# Altium schematic sheet 04_CapTouch.SchDoc: ECE315 Analog
size A; Date: 4/25/2017; ApprovedBy: JSK; CheckedBy: JSK; Author: JSK; CompanyName: University of Wisconsin; DrawnBy: JSK; Engineer: JSK; Organization: ECE 315; Address1: College of Engineering; Address2: 1415 Engineering Drive; Address3: Madison, WI 53706; Address4: ECE 315 Fall 2017; Revision: A; SheetNumber: 2; SheetTotal: 2; AssemblyNumber: EMG001; ApprovedDate: 4/25/2017
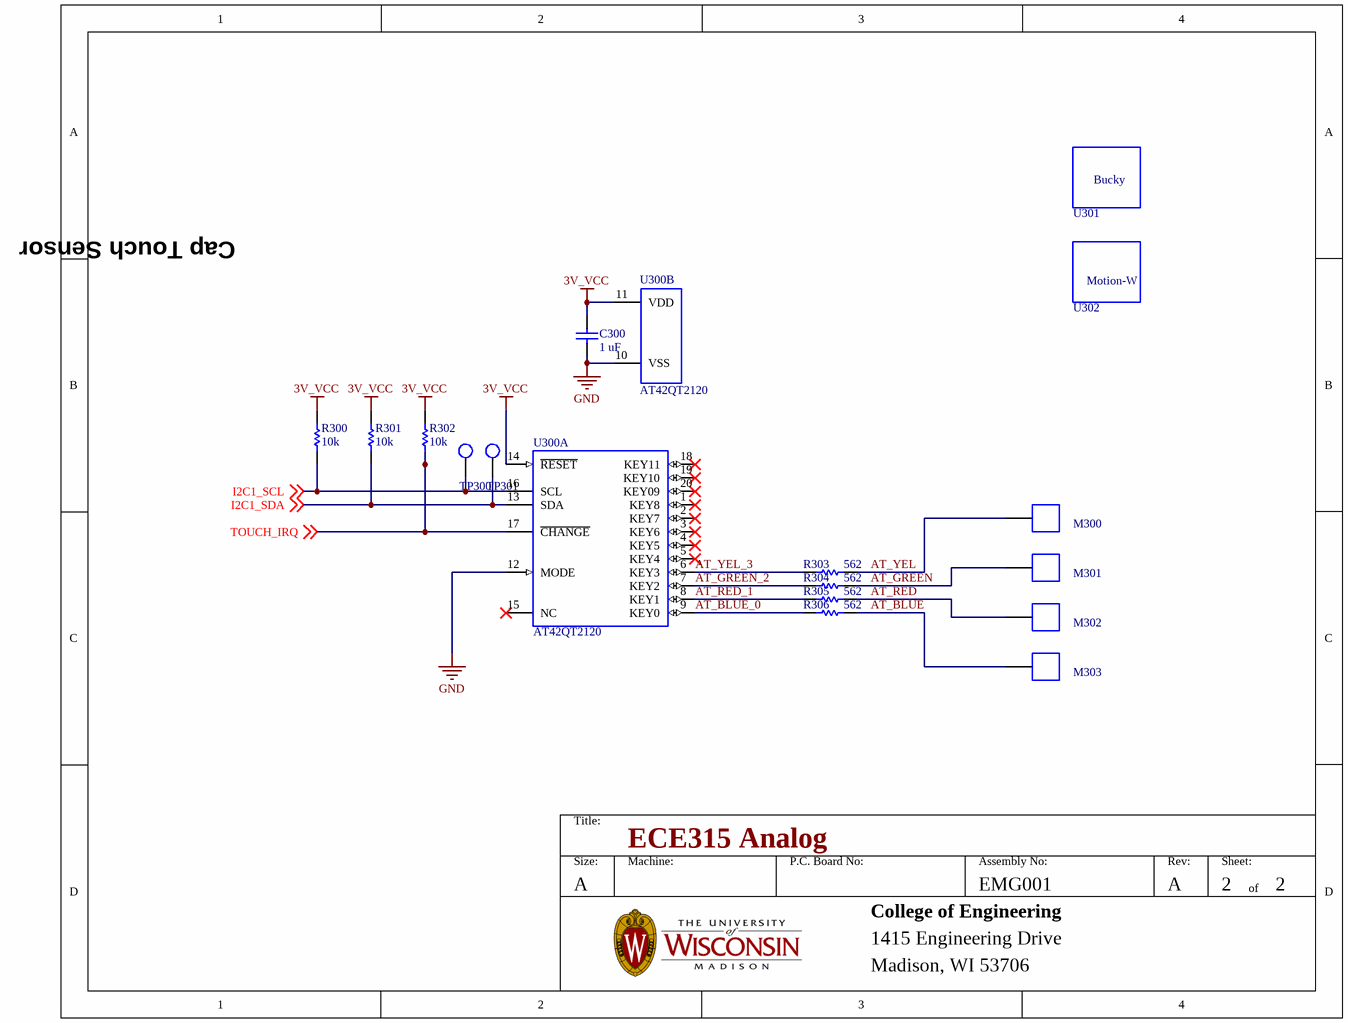
[diagram p0: 04_CapTouch.SchDoc]

## Parts
C300  Capacitance: 1 uF  [CAP_0805]  (hidden comment: CAP_0805_U_001.00)
M300  Mech_TouchPad  [TouchPad]  (value not drawn)  (no BOM)
M301  Mech_TouchPad  [TouchPad]  (value not drawn)  (no BOM)
M302  Mech_TouchPad  [TouchPad]  (value not drawn)  (no BOM)
M303  Mech_TouchPad  [TouchPad]  (value not drawn)  (no BOM)
R300  10K
R301  10K
R302  10K
R303  Resistance (Ohms): 562  [RES_0805]  (hidden comment: RES_0805_R_562_00)
R304  Resistance (Ohms): 562  [RES_0805]  (hidden comment: RES_0805_R_562_00)
R305  Resistance (Ohms): 562  [RES_0805]  (hidden comment: RES_0805_R_562_00)
R306  Resistance (Ohms): 562  [RES_0805]  (hidden comment: RES_0805_R_562_00)
TP300  TP_1206  [TP-SMC-1206]  (value not drawn)
TP301  TP_1206  [TP-SMC-1206]  (value not drawn)
U300  value AT42QT2120  [SOIC127P1030-20M]  (hidden comment: IC_AT42QT2120)  (parts A,B of 2)
U301  Bucky  [BuckyBadger]  (value not drawn)  (no BOM)
U302  Motion_W  [Motion_W]  (value not drawn)  (no BOM)

## Nets
3V_VCC: C300.1 R300.2 R301.2 R302.2 U300.11(VDD) U300.14(~{RESET})
GND: C300.2 U300.10(VSS) U300.12(MODE)
AT_BLUE: M303.1 R306.2
AT_BLUE_0: R306.1 U300.9(KEY0)
AT_GREEN: M301.1 R304.2
AT_GREEN_2: R304.1 U300.7(KEY2)
AT_RED: M302.1 R305.2
AT_RED_1: R305.1 U300.8(KEY1)
AT_YEL: M300.1 R303.2
AT_YEL_3: R303.1 U300.6(KEY3)
I2C1_SCL: R300.1 TP300.1 U300.16(SCL) ; off-sheet I2C1_SCL
I2C1_SDA: R301.1 TP301.1 U300.13(SDA) ; off-sheet I2C1_SDA
TOUCH_IRQ: R302.1 U300.17(~{CHANGE}) ; off-sheet TOUCH_IRQ

Not connected (* = marked no-connect by the designer): U300 1(KEY8)* 2(KEY7)* 3(KEY6)* 4(KEY5)* 5(KEY4)* 15(NC)* 18(KEY11)* 19(KEY10)* 20(KEY09)*

## Notes on the sheet
- Cap Touch Sensor
- Title:
- Size:
- A
- Machine:
- P.C. Board No:
- Assembly No:
- Rev:
- Sheet:
- of
- College of Engineering
- 1415 Engineering Drive
- Madison, WI 53706
- (in symbol Motion_W) Motion-W

## Library data of the parts
C300 = CAP_0805_U_001.00: CAP CER 1UF 16V 10% X7R 0805; Manufacturer: Kemet; Manufacturer Part Number: C0805C105K4RACTU; Part # Aliases: C0805C105K4RAC7800; Capacitance - nF: 1000 nF; Case Height: 0.9 mm; Case Length: 2 mm; Case Width: 1.2 mm; Class: Class 1; Dissipation Factor DF: 5; Temperature Coefficient / Code: +/- 15 %; Type: SMD MLCC X7R 6.3 - 250 VDC Commerical Grade; Tolerance: 10 %; Supplier 1: Digikey; Supplier Part Number 1: 399-1284-1-ND; Stock 1: 692931; Pricing 1: 1=0.12, 10=0.087, 100=0.0407, 500=0.0286, 1000=0.0236 (USD); Brand: Kemet; Case Code - in: 0805; Case Code - mm: 2012; Dimensions: 1.2 mm W x 2 mm L x 0.9 mm H; Dielectric: X7R; Lead Spacing: 0.75 mm; Factory Pack Quantity: 2500; Voltage Rating: 16 V; Product Category: Multilayer Ceramic Capacitors MLCC - SMD/SMT; RoHS: Details; Minimum Operating Temperature: - 55 C; Maximum Operating Temperature: + 125 C; Product: General Type MLCCs; Operating Temperature Range: - 55 C to + 125 C; Package / Case: 0805 (2012 metric); Packaging: Reel; Series: C0805C; Termination Style: SMD/SMT; Voltage Rating DC: 16 V; ComponentLink1URL: https://datasheet.ciiva.com/14585/70095383-14585511.pdf; ComponentLink1Description: https://datasheet.ciiva.com/14585/70095383-14585511.pdf; ComponentLink2URL: https://datasheet.ciiva.com/6074/1722731-6074364.pdf; ComponentLink2Description: https://datasheet.ciiva.com/6074/1722731-6074364.pdf; ComponentLink3URL: https://datasheet.ciiva.com/14603/70095383-14603388.pdf; ComponentLink3Description: https://datasheet.ciiva.com/14603/70095383-14603388.pdf; ComponentLink4URL: https://datasheet.ciiva.com/28692/1851736-28692942.pdf; ComponentLink4Description: https://datasheet.ciiva.com/28692/1851736-28692942.pdf; ComponentLink5URL: https://datasheet.ciiva.com/39122/docfinderpartnumberc0402c102k5ractu-39122926.pdf; ComponentLink5Description: https://datasheet.ciiva.com/39122/docfinderpartnumberc0402c102k5ractu-39122926.pdf
M300-M303 = Mech_TouchPad: Capacative Touch Sensor Pad
R300-R302 = RES_0805_K_010.00: RES SMD 10K OHM 1% 1/8W 0805; Manufacturer Part Number: ERJ-6ENF1002V; Manufacturer: Panasonic / Panasonic ECG; Temperature Coefficient: ± 200ppm/°C; Voltage Rating: 150V; Resistor Element Material: Thick Film; Power Rating: 125mW; Resistor Case Style: 0805; No. of Pins: 2; Product Range: PANASONIC - ERJ Series; Supplier 1: Digikey; Stock 1: 87; Pricing 1: 1=0.1, 10=0.041, 100=0.0167, 1000=0.0075, 2500=0.0065 (USD); Resistance Tolerance: ± 1%; Resistor Mounting: SMD; Series: ERJ; Resistor Element Type: Thick Film; ComponentLink1URL: https://datasheet.ciiva.com/11808/0900766b80f80784-11808080.pdf; ComponentLink1Description: https://datasheet.ciiva.com/11808/0900766b80f80784-11808080.pdf; ComponentLink2URL: https://datasheet.ciiva.com/16514/aoa0000ce2-16514021.pdf; ComponentLink2Description: https://datasheet.ciiva.com/16514/aoa0000ce2-16514021.pdf; ComponentLink3URL: https://datasheet.ciiva.com/27055/1988971-27055733.pdf; ComponentLink3Description: https://datasheet.ciiva.com/27055/1988971-27055733.pdf; ComponentLink4URL: https://datasheet.ciiva.com/16759/70260748-16759350.pdf; ComponentLink4Description: https://datasheet.ciiva.com/16759/70260748-16759350.pdf; ComponentLink5URL: https://datasheet.ciiva.com/16725/70260748-16725031.pdf; ComponentLink5Description: https://datasheet.ciiva.com/16725/70260748-16725031.pdf; ComponentLink6URL: https://datasheet.ciiva.com/7830/426256-7830745.pdf; ComponentLink6Description: https://datasheet.ciiva.com/7830/426256-7830745.pdf; ComponentLink7URL: https://datasheet.ciiva.com/46372/1678782-46372714.pdf; ComponentLink7Description: https://datasheet.ciiva.com/46372/1678782-46372714.pdf; ComponentLink8URL: https://datasheet.ciiva.com/46372/1678782-46372715.pdf; ComponentLink8Description: https://datasheet.ciiva.com/46372/1678782-46372715.pdf; ComponentLink9URL: https://datasheet.ciiva.com/17212/aoa0000ce2-17212108.pdf; ComponentLink9Description: https://datasheet.ciiva.com/17212/aoa0000ce2-17212108.pdf; ComponentLink10URL: https://datasheet.ciiva.com/30140/aoa0000ce2-30140236.pdf; ComponentLink10Description: https://datasheet.ciiva.com/30140/aoa0000ce2-30140236.pdf; ComponentLink11URL: https://datasheet.ciiva.com/16740/aoa0000ce2-16740669.pdf; ComponentLink11Description: https://datasheet.ciiva.com/16740/aoa0000ce2-16740669.pdf; ComponentLink12URL: https://datasheet.ciiva.com/24070/aoa0000ce2-24070702.pdf; ComponentLink12Description: https://datasheet.ciiva.com/24070/aoa0000ce2-24070702.pdf; Supplier Part Number 1: P10.0KCCT-ND; Resistance: 10k
R303-R306 = RES_0805_R_562_00: RES SMD 562 OHM 1% 1/8W 0805; Manufacturer: Panasonic / Panasonic ECG; Manufacturer Part Number: ERJ-6ENF5620V; Power (Watts): 0.125W, 1/8W; Temperature Coefficient: ±100ppm/°C; EDA / CAD Models: Download from Accelerated Designs; Online Catalog: ERJ Series; Kits: RSM2CA-ND  - RESISTR KIT 100-976 1/8W 4800PCS RSM2C-ND  - RES KIT 100-976 1/8W 19200PCS; Other Names: ERJ-6ENF5620 ERJ6ENF5620 P562CBK P562CCT; Supplier 1: Digikey; Supplier Part Number 1: P562CCT-ND; Category: Resistors; Stock 1: 13935; Pricing 1: 1=0.1, 10=0.041, 100=0.0167, 1000=0.0075, 2500=0.0065 (USD); Packaging: Cut Tape (CT); Tolerance: ±1%; Composition: Thick Film; Features: Automotive AEC-Q200; Operating Temperature: -55°C ~ 155°C; Package / Case: 0805 (2012 Metric); Supplier Device Package: 0805; Size / Dimension: 0.079" L x 0.049" W (2.00mm x 1.25mm); Height: 0.028" (0.70mm); Number of Terminations: 2; ComponentLink1URL: https://datasheet.ciiva.com/16757/70260748-16757879.pdf; ComponentLink1Description: https://datasheet.ciiva.com/16757/70260748-16757879.pdf; Standard Package: 1; Family: Chip Resistor - Surface Mount; Series: ERJ; ComponentLink2URL: https://datasheet.ciiva.com/46444/1678782-46444648.pdf; ComponentLink2Description: https://datasheet.ciiva.com/46444/1678782-46444648.pdf; ComponentLink3URL: https://datasheet.ciiva.com/7942/aoa0000ce2-7942396.pdf; ComponentLink3Description: https://datasheet.ciiva.com/7942/aoa0000ce2-7942396.pdf; ComponentLink4URL: https://datasheet.ciiva.com/17204/aoa0000ce2-17204893.pdf; ComponentLink4Description: https://datasheet.ciiva.com/17204/aoa0000ce2-17204893.pdf; ComponentLink5URL: https://datasheet.ciiva.com/16785/70260748-16785486.pdf; ComponentLink5Description: https://datasheet.ciiva.com/16785/70260748-16785486.pdf
TP300 TP301 = TP_1206: Test Point SMD 1206; Manufacturer: TE Connectivity (Tyco Electronics); Manufacturer Part Number: 1625854-1; Resistance Value: 0 Ohm; Temperature Coefficient: N/R; Supplier 1: Digi-Key; Supplier Part Number 1: A106143CT-ND; Stock 1: 31937; Pricing 1: 1=0.28, 10=0.261, 25=0.224, 50=0.1902, 100=0.1828, 250=0.1641, 500=0.1567, 1000=0.1306 (USD); Case Size: 1206; Dimension: 3.2 x 1.6 x 1.25mm; Family: RC; Mounting: Surface Mount; Operating Temperature: -55 to 125 C; Part No: 1625854-1; RoHS: Yes; Packaging: Tape and Reel; Termination Style: N/R; Terminal Pitch: N/R; Power Rating: N/R; Tolerance: N/R; ComponentLink1URL: https://datasheet.ciiva.com/6439/eng-ds-1773266-a-6439169.pdf; ComponentLink1Description: https://datasheet.ciiva.com/6439/eng-ds-1773266-a-6439169.pdf; ComponentLink2URL: https://datasheet.ciiva.com/30136/1773266-a-30136341.pdf; ComponentLink2Description: https://datasheet.ciiva.com/30136/1773266-a-30136341.pdf; ComponentLink3URL: https://datasheet.ciiva.com/6439/eng-ds-1773266-a-6439080.pdf; ComponentLink3Description: https://datasheet.ciiva.com/6439/eng-ds-1773266-a-6439080.pdf; ComponentLink4URL: https://datasheet.ciiva.com/6439/eng-ds-1773266-a-6439081.pdf; ComponentLink4Description: https://datasheet.ciiva.com/6439/eng-ds-1773266-a-6439081.pdf; ComponentLink5URL: https://datasheet.ciiva.com/6439/eng-ds-1773266-a-6439083.pdf; ComponentLink5Description: https://datasheet.ciiva.com/6439/eng-ds-1773266-a-6439083.pdf
U300 = IC_AT42QT2120: Touch Sensor, Atmel; Manufacturer Part Number: AT42QT2120-SUR; Proximity Detection: Yes; Number of Inputs: Up to 12; LED Driver Channels: Up to 10; Interface: I²C; Voltage - Supply: 1.8 V ~ 5.5 V; Supplier 1: Digi-Key; Supplier Part Number 1: AT42QT2120-SURCT-ND; Manufacturer: Atmel; RoHS: RoHS Compliant; Category: Sensors, Transducers; Stock 1: 1222; Pricing 1: 1=2.7, 10=2.436, 25=2.1828, 100=1.9627, 250=1.74276, 500=1.5228 (USD); Packaging: Cut Tape (CT); Type: Buttons, Slider, Wheel; Resolution: -; Current - Supply: -; Operating Temperature: -40°C ~ 85°C; Package / Case: 20-SOIC (0.295", 7.50mm Width); Supplier Device Package: 20-SOIC; ComponentLink1URL: http://www.atmel.com/images/doc9634.pdf; ComponentLink1Description: http://www.atmel.com/images/doc9634.pdf
U301 = Bucky: Bucky Badger Image; Manufacturer Part Number: UW Bucky
U302 = Motion_W: Motion W Image; Manufacturer Part Number: UW Bucky